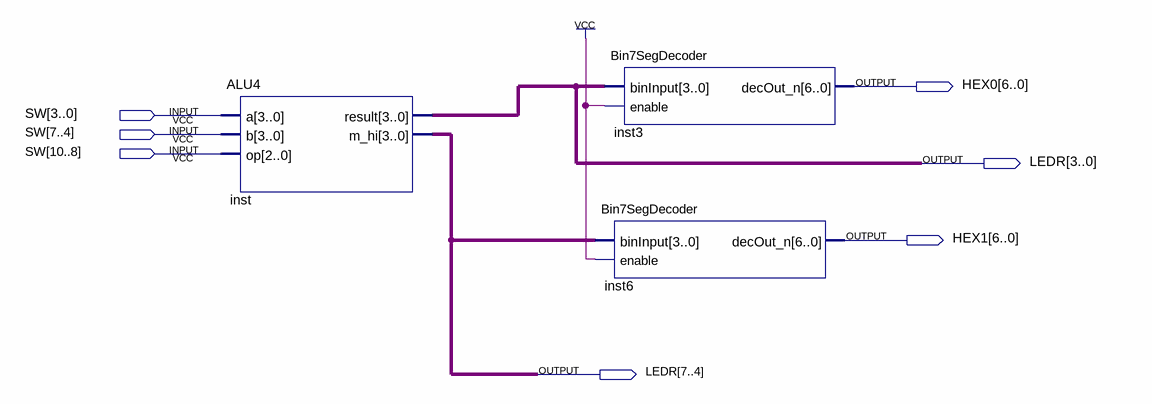
[diagram p0: schematic sheet]
// Quartus schematic ALUDemo.bdf as structural Verilog: 3 symbols, 7 pins
module ALUDemo (
  input  [10:0] SW,
  output [6:0] HEX0,
  output [7:0] LEDR,
  output [6:0] HEX1
);

  ALU4 inst (.a(SW[3:0]), .b(SW[7:4]), .op(SW[10:8]), .result(LEDR[3:0]), .m_hi(LEDR[7:4]));
  Bin7SegDecoder inst3 (.binInput(LEDR[3:0]), .enable(1'b1), .decOut_n(HEX0));
  Bin7SegDecoder inst6 (.binInput(LEDR[7:4]), .enable(1'b1), .decOut_n(HEX1));
endmodule
